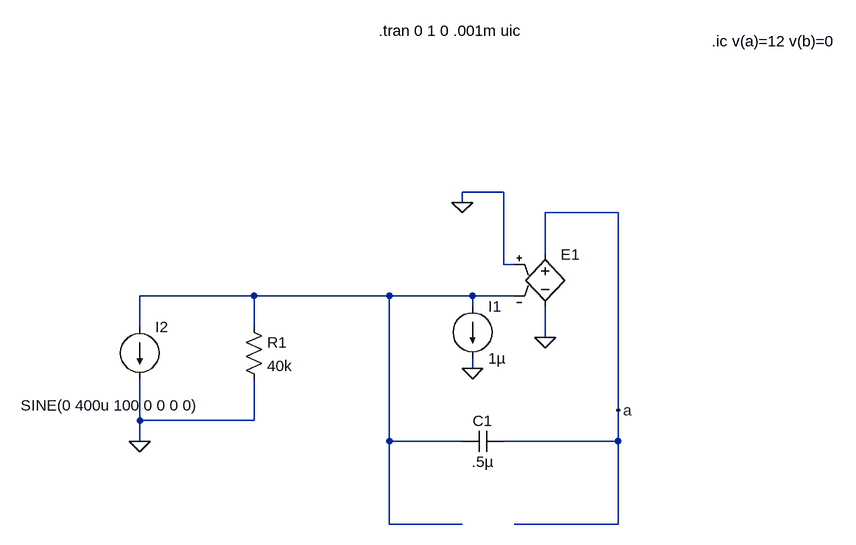
[diagram p0: schematic intideal3.asc]
intideal3.asc, the LTspice schematic file:
Version 4
SHEET 1 1748 680
WIRE 784 -16 720 -16
WIRE 720 0 720 -16
WIRE 960 16 848 16
WIRE 848 80 848 16
WIRE 784 96 784 -16
WIRE 800 96 784 96
WIRE 400 144 224 144
WIRE 608 144 400 144
WIRE 736 144 608 144
WIRE 800 144 736 144
WIRE 736 160 736 144
WIRE 224 192 224 144
WIRE 400 192 400 144
WIRE 848 208 848 160
WIRE 736 256 736 240
WIRE 960 320 960 16
WIRE 224 336 224 272
WIRE 400 336 400 272
WIRE 400 336 224 336
WIRE 224 368 224 336
WIRE 608 368 608 144
WIRE 720 368 608 368
WIRE 960 368 960 320
WIRE 960 368 784 368
WIRE 608 496 608 368
WIRE 720 496 608 496
WIRE 960 496 960 368
WIRE 960 496 800 496
FLAG 848 208 0
FLAG 224 368 0
FLAG 720 0 0
FLAG 960 320 a
FLAG 736 256 0
SYMBOL e 848 64 R0
WINDOW 3 24 96 Invisible 2
SYMATTR Value table=(-100,-12)(-60u,-12)(60u,12)(100,12)
SYMATTR InstName E1
SYMBOL cap 784 352 R90
WINDOW 0 0 32 VBottom 2
WINDOW 3 32 32 VTop 2
SYMATTR InstName C1
SYMATTR Value .5µ
SYMBOL current 736 160 R0
WINDOW 123 0 0 Left 2
WINDOW 39 0 0 Left 2
SYMATTR InstName I1
SYMATTR Value 1µ
SYMBOL current 224 192 R0
WINDOW 3 -183 121 Left 2
WINDOW 123 0 0 Left 2
WINDOW 39 0 0 Left 2
SYMATTR Value SINE(0 400u 100 0 0 0 0)
SYMATTR InstName I2
SYMBOL res 384 176 R0
SYMATTR InstName R1
SYMATTR Value 40k
TEXT 592 -264 Left 2 !.tran 0 1 0 .001m uic
TEXT 1104 -248 Left 2 !.ic v(a)=12 v(b)=0

The netlist it stands for:
* intideal3.asc
E1 a 0 0 N001 table=(-100,-12)(-60u,-12)(60u,12)(100,12)
C1 a N001 .5µ
I1 N001 0 1µ
I2 N001 0 SINE(0 400u 100 0 0 0 0)
R1 N001 0 40k
.tran 0 1 0 .001m uic
.ic v(a)=12 v(b)=0
.backanno
.end